# Altium schematic sheet EPS_Battery.SchDoc: Battery
size A4
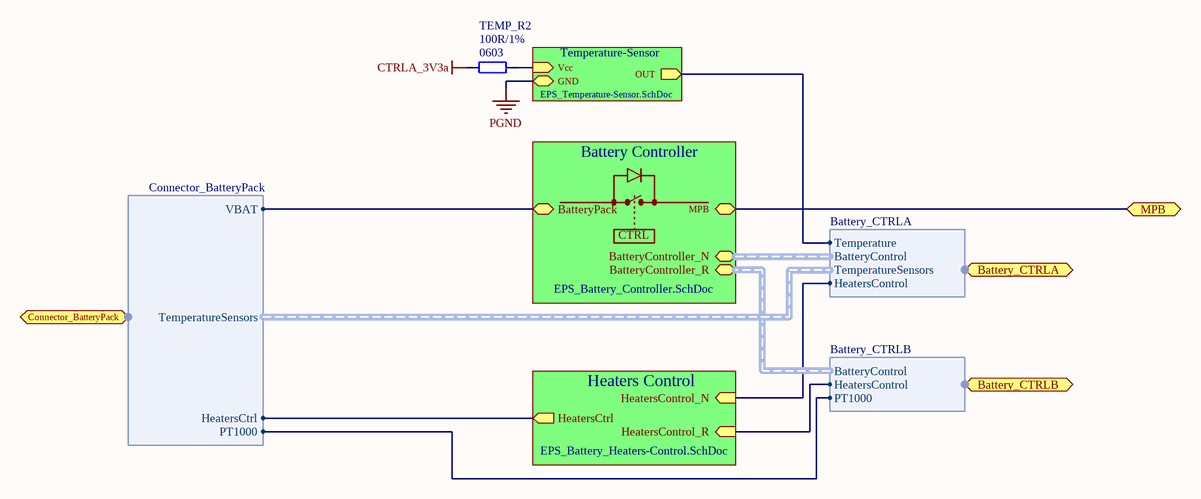
[diagram p0: EPS_Battery.SchDoc]

## Parts
TEMP_R2  Package: 0603  [SMD_Resistor_0603]  (hidden comment: 100R/1%)

## Sub-sheets
Battery Controller = EPS_Battery_Controller.SchDoc: MPB (bidir), BatteryController_N (harness BatteryController_N), BatteryController_R (harness BatteryController_R), BatteryPack
Heaters Control = EPS_Battery_Heaters-Control.SchDoc: HeatersCtrl (out), HeatersControl_N (in), HeatersControl_R (in)
Temperature-Sensor = EPS_Temperature-Sensor.SchDoc: OUT (out), Vcc (in), GND

## Ports
Battery_CTRLA (harness Battery_CTRLA), Battery_CTRLB (harness Battery_CTRLB), Connector_BatteryPack (harness Connector_BatteryPack), MPB (bidir)

## Harnesses
Connector_BatteryPack: VBAT, TemperatureSensors, HeatersCtrl, PT1000
Battery_CTRLA: BatteryControl, HeatersControl, TemperatureSensors, Temperature
Battery_CTRLB: BatteryControl, HeatersControl, PT1000

## Nets
CTRLA_3V3a: TEMP_R2.2
PGND: sheet Temperature-Sensor/GND
MPB: port MPB, sheet Battery Controller/MPB
NetTEMP_R2_1: TEMP_R2.1 ; sheet Temperature-Sensor/Vcc
(unnamed): sheet Battery Controller/BatteryPack, port Connector_BatteryPack.VBAT
(unnamed): sheet Heaters Control/HeatersCtrl, port Connector_BatteryPack.HeatersCtrl
(unnamed): sheet Heaters Control/HeatersControl_N, port Battery_CTRLA.HeatersControl
(unnamed): sheet Heaters Control/HeatersControl_R, port Battery_CTRLB.HeatersControl
(unnamed): sheet Temperature-Sensor/OUT, port Battery_CTRLA.Temperature
(unnamed): port Connector_BatteryPack.PT1000, port Battery_CTRLB.PT1000

## Notes on the sheet
- CTRL
- Title:
- Project:
- Author:
- Model:
- Document Number:
- Checked by:
- Rev:
- Date:
- Approved by:
- Sheet:
- of
- File name:

## Library data of the parts
TEMP_R2 = CRCW06031K00FKxxxx: 1k/1% Vishay CRCW 0603 Resistor. 100mW, 100ppm, 75V.; Manufacturer: Vishay; ManufacturerPartNumber: CRCW06031K00FKxxxx; Value: 100R/1%